# Altium schematic sheet sim800L.SchDoc: Sim800L
size A4; Author: Chelmis Muthoni; DrawnBy: Chelmis Muthoni; Organization: Data Integrated Ltd; Revision: 1
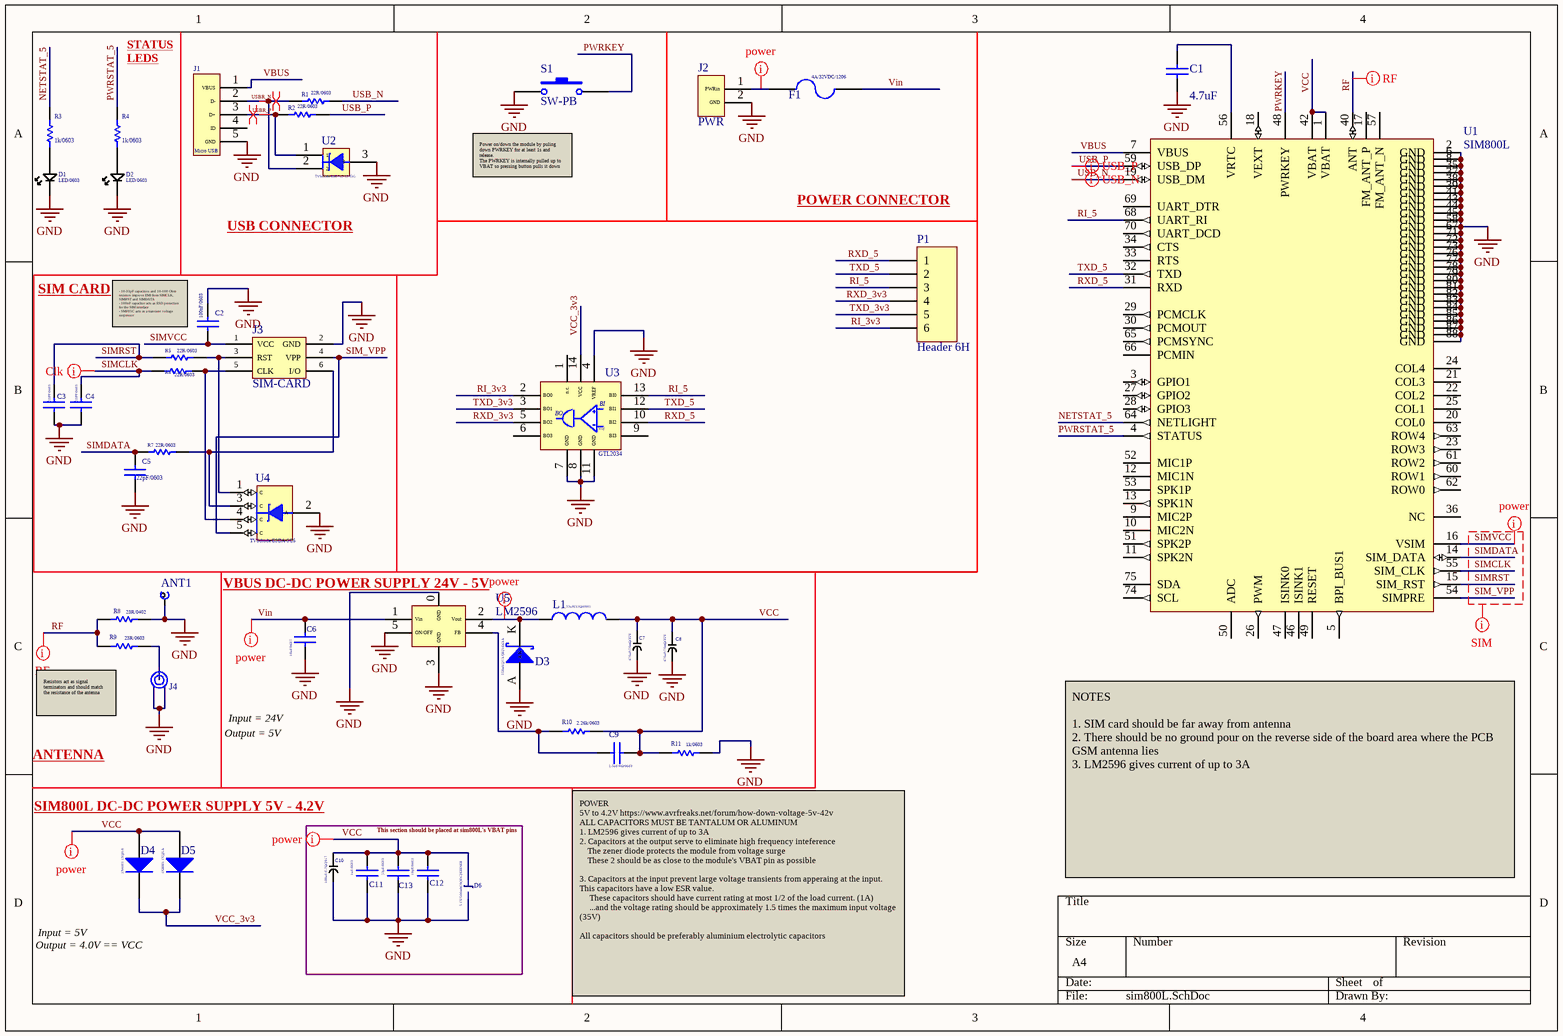
[diagram p0: sim800L.SchDoc]

## Parts
ANT1  GSM-ANT  [GSM-ANTENNA]  (value not drawn)
C1  value 4.7uF  [0603]  (hidden comment: Cap)
C2  value 100nF/0603  [0603]  (hidden comment: Cap)
C3  value 33PF/0603  [0603]  (hidden comment: Cap)
C4  value 33PF/0603  [0603]  (hidden comment: Cap)
C5  value 22pF/0603  [0603]  (hidden comment: Cap)
C6  value 10uF/0603  [0603]  (hidden comment: Cap)
C7  470uF/70mΩ/35V  [Cap-Radial]
C8  470uF/70mΩ/35V  [Cap-Radial]
C9  value 1.5nF/0Ω/0603  [0603]  (hidden comment: Cap)
C10  100uF/0.7Ω/2917  [2917-pol]
C11  value 1uF/0603  [0603]
C12  value 10pF/0603  [0603]
C13  value 33pF/0603  [0603]
D1  LED/0603  [0603-LED- POL]
D2  LED/0603  [0603-LED- POL]
D3  value 550mV@7A/D02144AA  [DO-214AA - Power Diode]  (hidden comment: Schottky Diode)
D4  1N4001 1V@1A  [D0-214-AC]
D5  1N4001 1V@1A  [D0-214-AC]
D6  5.1V/500mW/SOD128ZENER  [SOD128-DIODE]
F1  4A/32VDC/1206  [fuse]
J1  Micro USB  [micro_usb]
J2  PWR  [SCREW TERMINAL 1X2]
J3  SIM-CARD  [micro_sim]
J4  U.FL SMT coaxial connector  [U.FL_SMT_CON]  (value not drawn)
L1  value 33uH/33Ω/0805  [0805]  (hidden comment: Inductor)
P1  Header 6H  [HDR1X6]
R1  value 22R/0603  [0603]  (hidden comment: 0603)
R2  value 22R/0603  [0603]  (hidden comment: 0603)
R3  value 1k/0603  [0603]  (hidden comment: Res1)
R4  value 1k/0603  [0603]  (hidden comment: Res1)
R5  value 22R/0603  [0603]  (hidden comment: Res1)
R6  value 22R/0603  [0603]  (hidden comment: Res1)
R7  value 22R/0603  [0603]  (hidden comment: Res1)
R8  value 23R/0402  [0603]  (hidden comment: Res1)
R9  value 23R/0603  [0603]  (hidden comment: Res1)
R10  value 2.26k/0603  [0603]  (hidden comment: Res1)
R11  value 1k/0603  [0603]  (hidden comment: Res1)
S1  SW-PB  [SWITCH_smd_smt_2Lead]
U1  SIM800L  [SIM800L-FOOTPRINT]
U2  TVSdiode-ESD7L5.0DT5G  [SOT-723]
U3  GTL2034  [TSSOP14]
U4  TVSdiode-ESDA-SC5  [SOT23-5PIN]
U5  LM2596

## Blocks framed on the sheet
This section should be placed at sim800L's VBAT pins: C10-C13 D6

## Nets
GND: ANT1.1 C1.1 C2.2 C3.1 C4.1 C5.1 C6.1 C7.K C8.K C10.K C11.1 C12.1 C13.1 D1.K D2.K D3.A D6.A J1.5(GND) J2.2(GND) J3.2(GND) J4.2 J4.3 R8.2 R11.2 S1.1 U1.2(GND) U1.6(GND) U1.8(GND) U1.35(GND) U1.37(GND) U1.38(GND) U1.39(GND) U1.41(GND) U1.43(GND) U1.44(GND) U1.45(GND) U1.58(GND) U1.67(GND) U1.71(GND) U1.72(GND) U1.73(GND) U1.76(GND) U1.77(GND) U1.78(GND) U1.79(GND) U1.80(GND) U1.81(GND) U1.82(GND) U1.83(GND) U1.84(GND) U1.85(GND) U1.86(GND) U1.87(GND) U1.88(GND) U2.3 U3.4(VREF) U3.7(GND) U3.8(GND) U3.11(GND) U4.2(A) U5.0(GND) U5.3(GND) U5.5(ON/OFF)
NETSTAT_5: R3.2 U1.64(NETLIGHT)
PWRKEY: S1.2 U1.48(PWRKEY)
PWRSTAT_5: R4.2 U1.4(STATUS)
RF: R8.1 R9.1 U1.40(ANT)
RI_3v3: P1.6 U3.2(BO0)
RI_5: P1.3 U1.68(UART_RI) U3.13(BI0)
RXD_3v3: P1.4 U3.5(BO2)
RXD_5: P1.1 U1.31(RXD) U3.10(BI2)
SIM_VPP: J3.4(VPP) U1.54(SIMPRE) U4.5(C)
SIMCLK: C4.2 R6.1 U1.55(SIM_CLK)
SIMDATA: C5.2 R7.1 U1.14(SIM_DATA)
SIMRST: C3.2 R5.1 U1.15(SIM_RST)
SIMVCC: C2.1 J3.1(VCC) U1.16(VSIM)
TXD_3v3: P1.5 U3.3(BO1)
TXD_5: P1.2 U1.32(TXD) U3.12(BI1)
USB_N: R1.2 U1.19(USB_DM)
USB_P: R2.2 U1.59(USB_DP)
USBR_N: J1.2(D-) R1.1 U2.2
USBR_P: J1.3(D+) R2.1 U2.1
VBUS: J1.1(VBUS) U1.7(VBUS)
VCC: C7.A C8.A C9.1 C10.A C11.2 C12.2 C13.2 D4.1(A) D5.1(A) D6.K L1.2 R10.2 R11.1 U1.1(VBAT) U1.42(VBAT)
VCC_3v3: D4.2(K) D5.2(K) U3.14(VCC)
Vin: C6.2 F1.2 U5.1(Vin)
NetC1_2: C1.2 U1.56(VRTC)
NetC9_2: C9.2 R10.1 U5.4(FB)
NetD1_A: D1.A R3.1
NetD2_A: D2.A R4.1
NetD3_K: D3.K L1.1 U5.2(Vout)
NetF1_1: F1.1 J2.1(PWRin)
NetJ3_3: J3.3(RST) R5.2 U4.1(C)
NetJ3_5: J3.5(CLK) R6.2 U4.4(C)
NetJ3_6: J3.6(I/O) R7.2 U4.3(C)
NetJ4_1: J4.1 R9.2

Not connected (* = marked no-connect by the designer): J1 4(ID); U1 3(GPIO1) 5(BPI_BUS1) 9(MIC2P) 10(MIC2N) 11(SPK2N) 12(MIC1N) 13(SPK1N) 17(FM_ANT_P) 18(VEXT) 20(COL0) 21(COL3) 22(COL2) 23(ROW3) 24(COL4) 25(COL1) 26(PWM) 27(GPIO2) 28(GPIO3) 29(PCMCLK) 30(PCMOUT) 33(RTS) 34(CTS) 36(NC) 46(ISINK1) 47(ISINK0) 49(RESET) 50(ADC) 51(SPK2P) 52(MIC1P) 53(SPK1P) 57(FM_ANT_N) 60(ROW1) 61(ROW2) 62(ROW0) 63(ROW4) 65(PCMSYNC) 66(PCMIN) 69(UART_DTR) 70(UART_DCD) 74(SCL) 75(SDA); U3 1(n.c.) 6(BO3) 9(BI3)

## Layout directives
differential pair; net class DIFFPAIR: USB_N, USB_P, USBR_N, USBR_P
net class Power: NetD3_K, NetF1_1, SIMVCC, VCC, Vin
net class RF: RF
net class Clk: SIMCLK
net class SIM: SIM_VPP, SIMCLK, SIMDATA, SIMRST, SIMVCC

## Notes on the sheet
- STATUS LEDS
- (near S1) Power on/down the module by puling down PWRKEY for at least 1s and release.
  The PWRKEY is internally pulled up to VBAT so pressing button pulls it down
- USB CONNECTOR
- (near P1) POWER CONNECTOR
- SIM CARD
- - 10-33pF capacitors and 10-100 Ohm resistors improve EMI from SIMCLK, SIMRST and SIMDATA
  - 100nF capacitor acts as ESD protection for the SIM interface
  - SMF05C acts as a transient voltage surpressor
- (near U5) VBUS DC-DC POWER SUPPLY 24V - 5V
- Resistors act as signal terminators and should match the resistance of the antenna
- Input = 24V
- ANTENNA
- Output = 5V
- SIM800L DC-DC POWER SUPPLY 5V - 4.2V
- NOTES
  1. SIM card should be far away from antenna
  2. There should be no ground pour on the reverse side of the board area where the PCB GSM antenna lies
  3. LM2596 gives current of up to 3A
- Output = 4.0V == VCC
- Input = 5V
- POWER
  5V to 4.2V https://www.avrfreaks.net/forum/how-down-voltage-5v-42v
  ALL CAPACITORS MUST BE TANTALUM OR ALUMINUM
  1. LM2596 gives current of up to 3A
  2. Capacitors at the output serve to eliminate high frequency inteference
  The zener diode protects the module from voltage surge
  These 2 should be as close to the module's VBAT pin as possible
  3. Capacitors at the input prevent large voltage transients from apperaing at the input. This capacitors have a low ESR value.
  These capacitors should have current rating at most 1/2 of the load current. (1A)
  ...and the voltage rating should be approximately 1.5 times the maximum input voltage (35V)
  All capacitors should be preferably aluminium electrolytic capacitors
- (in symbol GTL2034) BI; BO; Vref

## Library data of the parts
C1-C6 C9 C11-C13 = Cap: Capacitor; Published: 8-Jun-2000; LatestRevisionDate: 17-Jul-2002; LatestRevisionNote: Re-released for DXP Platform.; PackageReference: RAD-0.3; Publisher: Altium Limited; PackageDescription: Radial Cap, Thru-Hole; 2 Leads; 0.3 in Pin Spacing
C7 C8 C10 = Cap-Pol
D1 D2 = LED-SMD
D4 D5 = Diode 1N4001: 1 Amp General Purpose Rectifier; Published: 8-Jun-2000; LatestRevisionDate: 17-Jul-2002; LatestRevisionNote: Re-released for DXP Platform.; DatasheetVersion: 1998; PackageVersion: Aug-1999; PackageReference: DO-41; Publisher: Altium Limited; PackageDescription: Diode, Axial; Body 5.2 x 2.7 mm (LxDia. max), Lead Dia. 0.86 mm (max); Code_JEDEC: DO-204-AL; ComponentLink1Description: Manufacturer Link; ComponentLink1URL: http://www.fairchildsemi.com/; ComponentLink2Description: Datasheet; ComponentLink2URL: http://www.fairchildsemi.com/ds/1N%2F1N4001.pdf
D6 = ZENER-DIODE: Zener Diode
F1 = Fuse 2: Fuse; Published: 8-Jun-2000; LatestRevisionDate: 17-Jul-2002; LatestRevisionNote: Re-released for DXP Platform.; PackageReference: PIN-W2/E2.8; Publisher: Altium Limited; PackageDescription: Thru-Hole; 2 Leads
J1 = USB - micro B
J2 = Header 2
J3 = XNT-0121AAAA07A: 6-PIN SIM HOLDER
L1 = Inductor: Code_IEC: 1005; Published: 8-Jun-2000; LatestRevisionDate: 29-May-2009; LatestRevisionNote: IPC-7351 Footprint Added.; PackageReference: 0402-A; Publisher: Altium Limited; PackageDescription: Chip Inductor; Code_JEITA: 0402
P1 = Header 6H: Header, 6-Pin, Right Angle; LatestRevisionDate: 17-Jul-2002; LatestRevisionNote: Re-released for DXP Platform.; Publisher: Altium Limited
R1-R11 = Res1: Resistor; Published: 8-Jun-2000; LatestRevisionDate: 17-Jul-2002; LatestRevisionNote: Re-released for DXP Platform.; PackageReference: AXIAL-0.3; Publisher: Altium Limited; PackageDescription: Axial Device, Thru-Hole; 2 Leads; 0.3 in Pin Spacing
S1 = SW-PB: Switch; Published: 24-Mar-1999; LatestRevisionDate: 17-Jul-2002; LatestRevisionNote: Re-released for DXP Platform.; PackageReference: SPST-2; Publisher: Altium Limited; PackageDescription: Switch; 2 Leads
U2 = SPS3222
U4 = SMS05T1